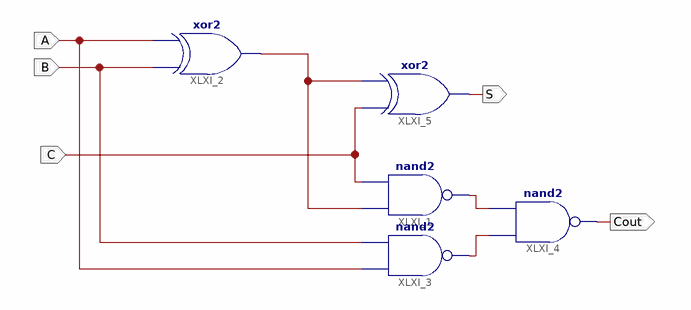
[diagram p0: schematic sheet 1]
// Xilinx ISE schematic FA.sch (spartan3e) as structural Verilog: 5 symbols, 5 ports
module FA (
  input  C,
  input  B,
  input  A,
  output S,
  output Cout
);

  wire XLXN_2, XLXN_11, XLXN_12;

  xor XLXI_2 (XLXN_2, B, A);
  xor XLXI_5 (S, C, XLXN_2);
  nand XLXI_1 (XLXN_11, XLXN_2, C);
  nand XLXI_3 (XLXN_12, A, B);
  nand XLXI_4 (Cout, XLXN_12, XLXN_11);
endmodule
